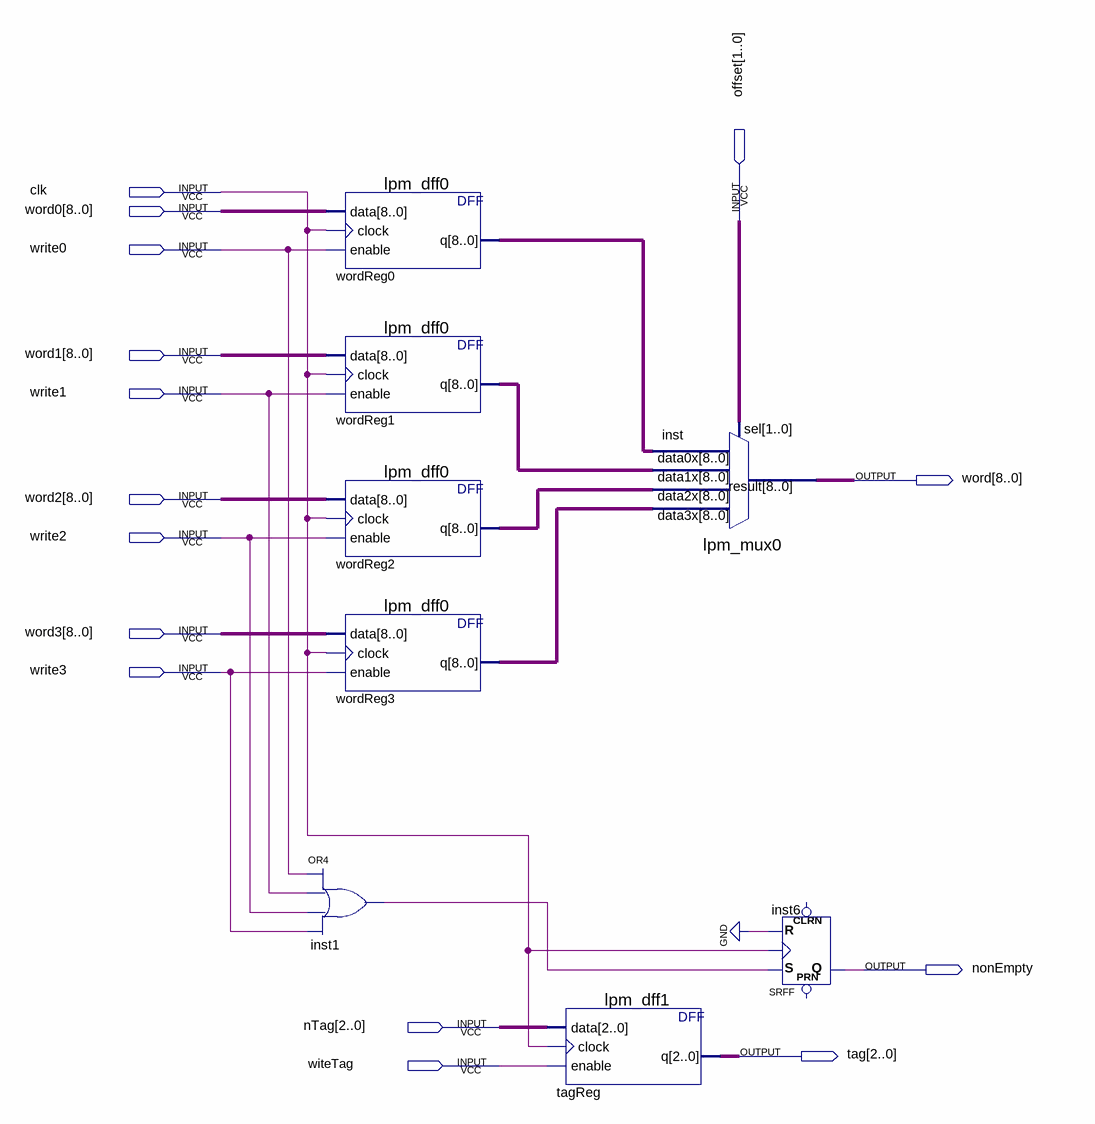
[diagram p0: schematic sheet]
// Quartus schematic Cash_Row.bdf as structural Verilog: 8 symbols, 15 pins
module Cash_Row (
  input  clk,
  input  [8:0] word0,
  input  [1:0] offset,
  input  write0,
  input  [8:0] word1,
  input  write1,
  input  [8:0] word2,
  input  write2,
  input  [8:0] word3,
  input  write3,
  input  [2:0] nTag,
  input  witeTag,
  output [8:0] word,
  output nonEmpty,
  output [2:0] tag
);

  wire inst1_out;
  wire [8:0] wordReg0_q, wordReg1_q, wordReg2_q, wordReg3_q;

  or inst1 (inst1_out, write0, write1, write2, write3);
  lpm_dff0 wordReg0 (.data(word0), .clock(clk), .enable(write0), .q(wordReg0_q));
  lpm_dff0 wordReg1 (.data(word1), .clock(clk), .enable(write1), .q(wordReg1_q));
  lpm_dff0 wordReg2 (.data(word2), .clock(clk), .enable(write2), .q(wordReg2_q));
  lpm_dff0 wordReg3 (.data(word3), .clock(clk), .enable(write3), .q(wordReg3_q));
  lpm_dff1 tagReg (.data(nTag), .clock(clk), .enable(witeTag), .q(tag));
  lpm_mux0 inst (
    .data3x(wordReg3_q), .data2x(wordReg2_q), .data1x(wordReg1_q), .data0x(wordReg0_q), .sel(offset),
    .result(word));
  SRFF inst6 (.S(inst1_out), .R(1'b0), .CLK(clk), .Q(nonEmpty));  // open: PRN, CLRN
endmodule
